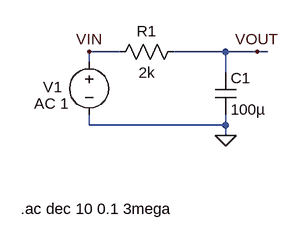
[diagram p0: schematic Temperature sensor filter_LP.asc]
Temperature sensor filter_LP.asc, the LTspice schematic file:
Version 4.1
SHEET 1 880 680
WIRE 96 128 48 128
WIRE 256 128 176 128
WIRE 304 128 256 128
WIRE 320 128 304 128
WIRE 48 144 48 128
WIRE 256 160 256 128
WIRE 48 240 48 224
WIRE 256 240 256 224
WIRE 256 240 48 240
WIRE 256 256 256 240
FLAG 256 256 0
FLAG 48 128 VIN
FLAG 304 128 VOUT
SYMBOL res 192 112 R90
WINDOW 0 0 56 VBottom 2
WINDOW 3 32 56 VTop 2
SYMATTR InstName R1
SYMATTR Value 2k
SYMBOL cap 240 160 R0
SYMATTR InstName C1
SYMATTR Value 100µ
SYMBOL voltage 48 128 R0
WINDOW 123 -84 79 Left 2
WINDOW 39 0 0 Left 0
WINDOW 0 -70 54 Left 2
SYMATTR Value2 AC 1
SYMATTR InstName V1
SYMATTR Value ""
TEXT -56 368 Left 2 !.ac dec 10 0.1 3mega

The netlist it stands for:
* Temperature sensor filter_LP.asc
R1 VOUT VIN 2k
C1 VOUT 0 100µ
V1 VIN 0 AC 1
.ac dec 10 0.1 3mega
.backanno
.end

* Results of the author's LTspice run, read from the files saved beside the schematic
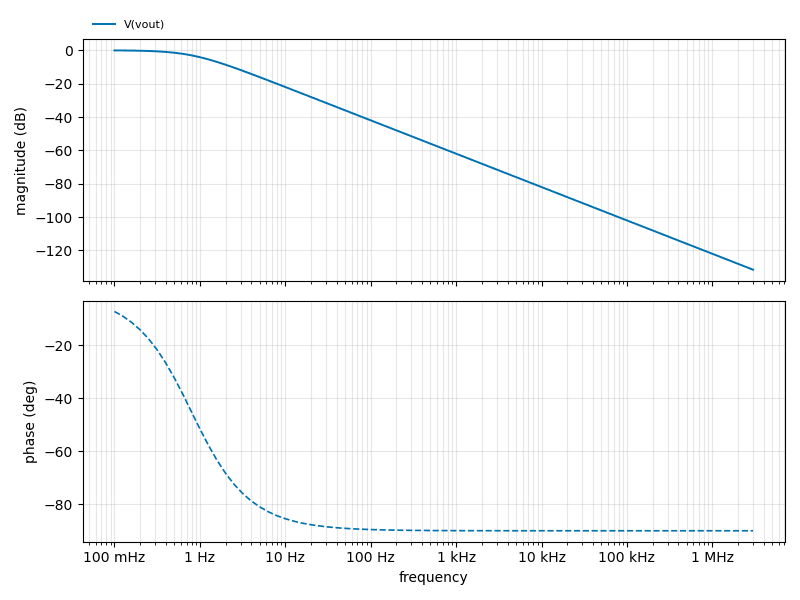
[diagram p1: AC Analysis of Temperature sensor filter_LP.asc, plotted from the saved traces]
* AC Analysis, 1 run:
*   V(vout): -0.07 dB at 100 mHz, -131.53 dB at 3 MHz, peak -0.07 dB at 100 mHz, 3 dB below the peak at 806.9 mHz